# Altium schematic sheet TEMPLATE_Connectors.SchDoc: Connectors
size Tabloid; SheetNumber: 4; SheetTotal: 4; Sheet_Name: Connectors; Size: 11x17
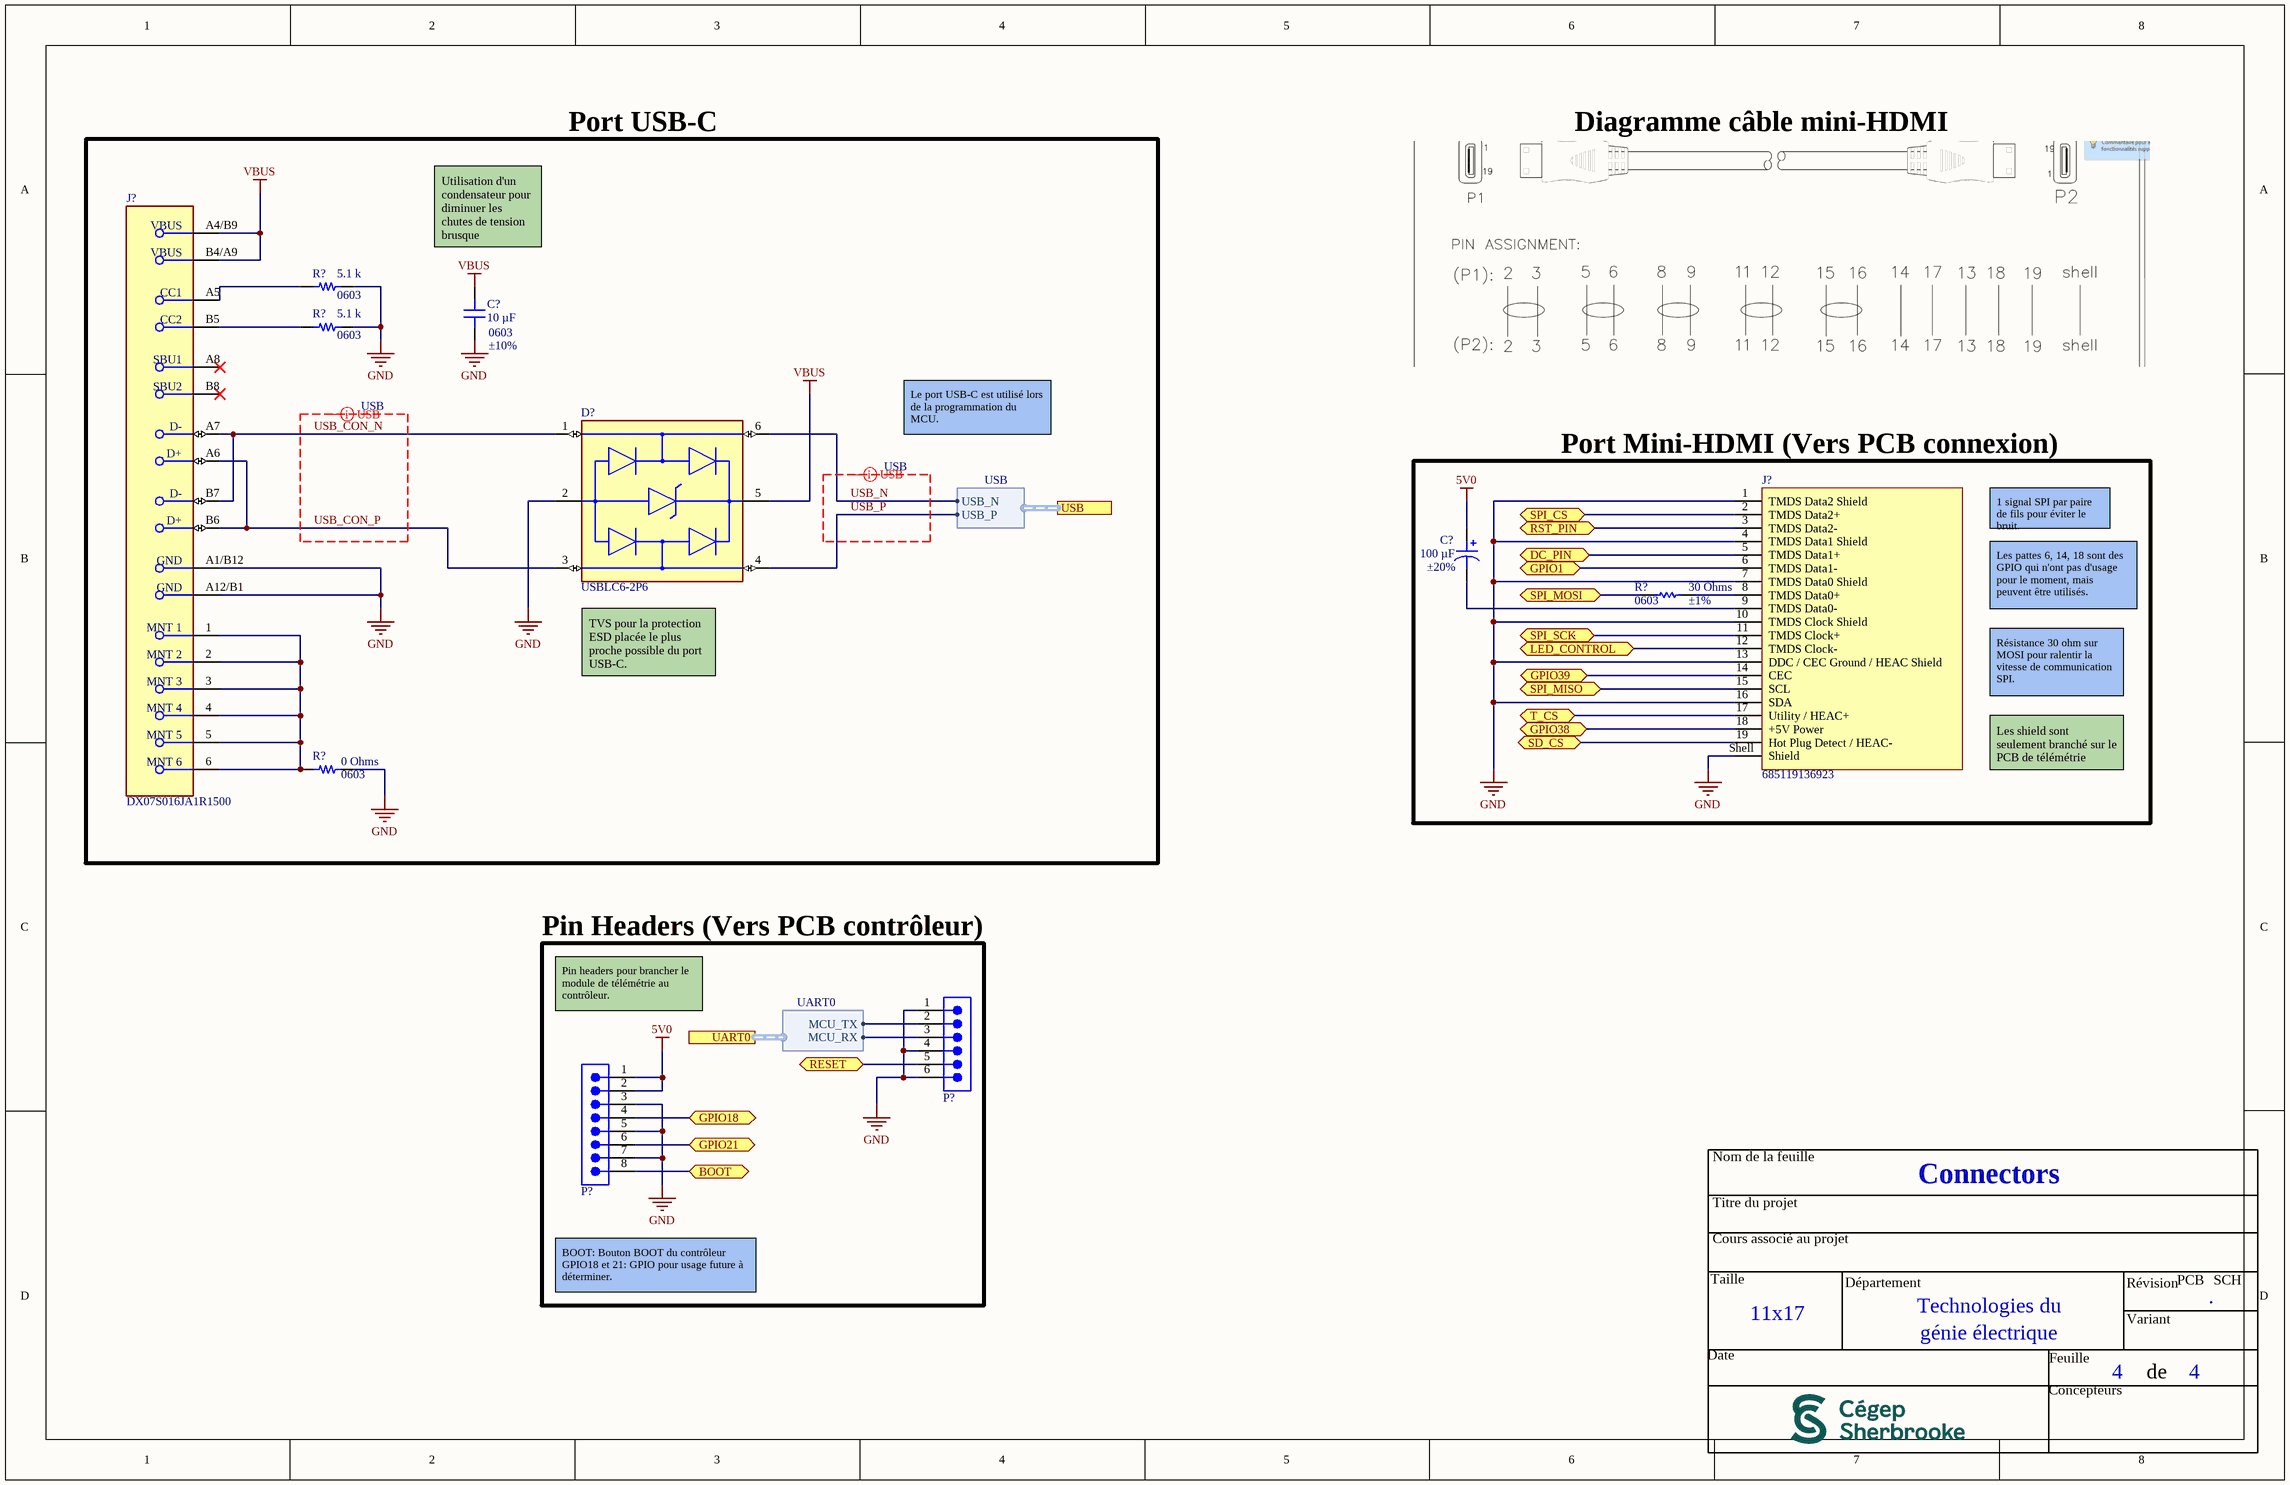
[diagram p0: TEMPLATE_Connectors.SchDoc]

## Parts
(Parts that share a designator on the sheet are numbered #1, #2 ... from top to bottom, then left to right.)
C?#1  Device Package: 0603  Tolerance: ±10%  [CAP 0603_1608]  (hidden comment: 10 µF)
C?#2  100 µF  Tolerance: ±20%  [CAP ALSMD 6.6MM H6.1MM]
D?  USBLC6-2P6  [FP-SOT-666-MFG]
J?#1  DX07S016JA1R1500  [FP-DX07S016JA1R1500-MFG]
J?#2  685119136923  [685119136923]
P?#1  61300611121  [61300611121]  (value not drawn)
P?#2  61300811121  [61300811121]  (value not drawn)
R?#1  Package / Case: 0603  [RES 0603_1608]  (hidden comment: 5.1 k)
R?#2  Package / Case: 0603  [RES 0603_1608]  (hidden comment: 5.1 k)
R?#3  ERJ3EKF30R0V  [RESC1608X55X30LL15T15]  (value not drawn)
R?#4  Supplier Device Package: 0603  [RES 0603_1608]  (hidden comment: 0 Ohms)

## Blocks framed on the sheet
Port USB-C: C?#1 D? J?#1 R?#1 R?#2 R?#4
Port Mini-HDMI (Vers PCB connexion): C?#2 J?#2 R?#3
Pin Headers (Vers PCB contrôleur): P?#1 P?#2

## Ports
BOOT (bidir), DC_PIN (bidir), GPIO1 (bidir), GPIO18 (bidir), GPIO21 (bidir), GPIO38 (bidir), GPIO39 (bidir), LED_CONTROL (bidir), RESET (bidir), RST_PIN (bidir), SD_CS (bidir), SPI_CS (bidir), SPI_MISO (bidir), SPI_MOSI (bidir), SPI_SCK (bidir), T_CS (bidir), UART0 (harness UART0), USB (harness USB)

## Harnesses
UART0: MCU_TX, MCU_RX
USB: USB_N, USB_P

## Nets
5V0: C?#2.1 P?#2.1 P?#2.2
GND: C?#1.1 D?.2(GND) J?#1.A1/B12(GND) J?#1.A12/B1(GND) J?#2.1(TMDS_Data2_Shield) J?#2.4(TMDS_Data1_Shield) J?#2.7(TMDS_Data0_Shield) J?#2.10(TMDS_Clock_Shield) J?#2.13(DDC_/_CEC_Ground_/_HEAC_Shield) J?#2.16(SDA) J?#2.Shell(Shield) P?#1.1 P?#1.4 P?#1.6 P?#2.3 P?#2.5 P?#2.7 R?#1.1 R?#2.1 R?#4.2
VBUS: C?#1.2 D?.5(VBUS) J?#1.A4/B9(VBUS) J?#1.B4/A9(VBUS)
BOOT: P?#2.8 ; port BOOT
DC_PIN: J?#2.5(TMDS_Data1+) ; port DC_PIN
GPIO1: J?#2.6(TMDS_Data1-) ; port GPIO1
GPIO18: P?#2.4 ; port GPIO18
GPIO21: P?#2.6 ; port GPIO21
GPIO38: J?#2.18(+5V_Power) ; port GPIO38
GPIO39: J?#2.14(CEC) ; port GPIO39
LED_CONTROL: J?#2.12(TMDS_Clock-) ; port LED_CONTROL
RESET: P?#1.5 ; port RESET
RST_PIN: J?#2.3(TMDS_Data2-) ; port RST_PIN
SD_CS: J?#2.19(Hot_Plug_Detect_/_HEAC-) ; port SD_CS
SPI_CS: J?#2.2(TMDS_Data2+) ; port SPI_CS
SPI_MISO: J?#2.15(SCL) ; port SPI_MISO
SPI_MOSI: R?#3.1 ; port SPI_MOSI
SPI_SCK: J?#2.11(TMDS_Clock+) ; port SPI_SCK
T_CS: J?#2.17(Utility_/_HEAC+) ; port T_CS
USB_CON_N: D?.1(I/O1) J?#1.A7(D-) J?#1.B7(D-)
USB_CON_P: D?.3(I/O2) J?#1.A6(D+) J?#1.B6(D+)
USB_N: D?.6(I/O1) ; port USB.USB_N
USB_P: D?.4(I/O2) ; port USB.USB_P
NetC?#2_2: C?#2.2 J?#2.9(TMDS_Data0-)
NetJ?#1_1: J?#1.1(MNT_1) J?#1.2(MNT_2) J?#1.3(MNT_3) J?#1.4(MNT_4) J?#1.5(MNT_5) J?#1.6(MNT_6) R?#4.1
NetJ?#1_A5: J?#1.A5(CC1) R?#1.2
NetJ?#1_B5: J?#1.B5(CC2) R?#2.2
NetJ?#2_8: J?#2.8(TMDS_Data0+) R?#3.2
NetP?#1_2: P?#1.2 ; port UART0.MCU_TX
NetP?#1_3: P?#1.3 ; port UART0.MCU_RX

Not connected (* = marked no-connect by the designer): J?#1 A8(SBU1)* B8(SBU2)*

## Layout directives
differential pair: USB_CON_N, USB_CON_P, USB_N, USB_P

## Notes on the sheet
- Diagramme câble mini-HDMI
- Utilisation d'un condensateur pour diminuer les chutes de tension brusque
- USB
- Le port USB-C est utilisé lors de la programmation du MCU.
- 1 signal SPI par paire de fils pour éviter le bruit.
- (near R?#3) 0603
- (near R?#3) 30 Ohms
- (near R?#3) ±1%
- Les pattes 6, 14, 18 sont des GPIO qui n'ont pas d'usage pour le moment, mais peuvent être utilisés.
- (near D?) TVS pour la protection ESD placée le plus proche possible du port USB-C.
- Résistance 30 ohm sur MOSI pour ralentir la vitesse de communication SPI.
- Les shield sont seulement branché sur le PCB de télémétrie
- Pin headers pour brancher le module de télémétrie au contrôleur.
- BOOT: Bouton BOOT du contrôleur GPIO18 et 21: GPIO pour usage future à déterminer.
- Nom de la feuille
- Titre du projet
- Cours associé au projet
- Taille
- Département
- Technologies du
- Révision
- PCB
- .
- SCH
- Date
- génie électrique
- Feuille
- Variant
- de
- Concepteurs

## Library data of the parts
C?#1 = GRT188R61A106KE13D: CAP CER 10UF 10V X5R 0603; manufacturer: Murata Electronics; Part Number: GRT188R61A106KE13D; Value: 10 µF; Applications: Automotive; Capacitance: 10 µF; componentlink1description: Datasheet; componentlink1url: https://search.murata.co.jp/Ceramy/image/img/A01X/G101/ENG/GRT188R61A106KE13-01.pdf; componentlink2description: DigiKey Link; componentlink2url: https://www.digikey.com/en/products/detail/murata-electronics/GRT188R61A106KE13D/5416733; Features: Derating Recommended; lastupdated: 2/9/2024 8:10:30 PM; Lifecycle Status: Active; Minimum Order: 1; Mounting Type: Surface Mount, MLCC; Operating Temperature: -55°C ~ 85°C; Package / Case: 0603 (1608 Metric); packaging: TapeAndReel; partid: 2522; Part Status: Active; price: 0.06; Ratings: AEC-Q200; series: GRT; Size / Dimension: 0.063" L x 0.031" W (1.60mm x 0.80mm); Supplier 1: DigiKey; Supplier Part Number 1: 490-12311-1-ND; Temperature Coefficient: X5R; Thickness (Max): 0.037" (0.95mm); Voltage - Rated: 10V
C?#2 = 10SGV100M6.3X6.1: CAP ALUM 100UF 20% 10V SMD; manufacturer: Rubycon; Lifetime @ Temp.: 2000 Hrs @ 105°C; Polarization: Polar; Ripple Current @ High Frequency: 85.2 mA @ 10 kHz; Ripple Current @ Low Frequency: 71 mA @ 120 Hz; Surface Mount Land Size: 0.260" L x 0.260" W (6.60mm x 6.60mm); Part Number: 10SGV100M6.3X6.1; Applications: Automotive; Capacitance: 100 µF; componentlink1description: Datasheet; componentlink1url: http://www.rubycon.co.jp/en/catalog/e_pdfs/aluminum/e_sgv.pdf; componentlink2description: DigiKey Link; componentlink2url: https://www.digikey.com/en/products/detail/rubycon/10SGV100M6-3X6-1/3568604; Device Package: Radial, Can - SMD; Height - Seated (Max): 0.240" (6.10mm); lastupdated: 6/3/2024 8:16:10 PM; Lifecycle Status: Active; Minimum Order: 1; Mounting Type: Surface Mount; Operating Temperature: -55°C ~ 105°C; Package / Case: Radial, Can - SMD; packaging: TapeAndReel; partid: 8082; Part Status: Active; price: 0.08; Ratings: AEC-Q200; series: SGV; Size / Dimension: 0.248" Dia (6.30mm); Supplier 1: DigiKey; Supplier Part Number 1: 1189-2392-1-ND; value: 100 µF; Voltage - Rated: 10 V
D? = CMP-12225-000058-1: TVS DIODE 5.25V 17V SOT666; Min Breakdown Voltage: 6V; Power Line Protection: Yes; Element Configuration: Dual; Test Current: 1mA; Working Voltage: 5V; Number of Channels: 2; Max Reverse Leakage Current: 150nA; Direction: Unidirectional; Peak Pulse Current: 5A; Number of Elements: 1; Capacitance: 3.5pF; Max Breakdown Voltage: 6V; Height: 0.6mm; Depth: 1.3mm; Contact Plating: Tin; Reverse Breakdown Voltage: 6V; REACH SVHC: No SVHC; Operating Supply Voltage: 5V; Width: 1.3mm; Max Operating Temperature: 125°C; Reverse Standoff Voltage: 5V; ESD Protection: Yes; Package Quantity: 1; Termination: SMD/SMT; Length: 1.7mm; Leakage Current: 150nA; Number of Bidirectional Channels: 2; Case/Package: SOT-666; Min Operating Temperature: -40°C; Number of Pins: 6; Clamping Voltage: 17V; Breakdown Voltage: 6V; Lead Free: Lead Free; Radiation Hardening: No; Packaging: Tape and Reel; Mount: Surface Mount; Polarity: Unidirectional
J?#1 = CMP-19038-000003-1: CONN RCP USB2.0 TYP C 24P SMD RA
J?#2 = CMP-1502-00171-2: NexarPartId: 19499823; Number of Contacts: 19; Gender: Receptacle; Operating Supply Voltage: 40V; Contact Resistance: 30mΩ; Body Material: Brass; Connector Type: HDMI; Current Rating: 500mA; Insulation Resistance: 100MΩ; Lead Free: Lead Free; Max Operating Temperature: 85°C; Packaging: Tape and Reel; Min Operating Temperature: -25°C; Features: Shielded; Orientation: Horizontal; Height: 3.45mm; Number of Positions: 19; Voltage Rating: 40V; Number of Pins: 19; Mount: Horizontal, Surface Mount; Contact Material: Gold; Termination: SMD/SMT; Contact Plating: Gold; RoHS: Compliant; REACH SVHC: Unknown
P?#1 = 61300611121: WR-PHD Pin Header, THT, Vertical, pitch 2.54mm, 1 Row, 6P; Manufacturer: Wurth Elektronik; Contact Resistance: 20mOhm; Rated Current: 3A; Working Voltage: 250V; Withstanding Voltage: 500V; Manufacturer Part Number: 61300611121; Category: Board-to-Board Connectors; Match Code: WR-PHD; ComponentLink1Description: Website Link; ComponentLink1URL: https://www.we-online.com/redexpert/article/61300611121?ad; ComponentLink2Description: Datasheet Link; ComponentLink2URL: https://www.we-online.com/redexpert/spec/61300611121?ad; Mount: Through Hole; Operating Temperature Max: 105°C; Operating Temperature Min: -40°C; Packaging: Bag; Gender: Pin Header; Number of Pins: 6; Number of Rows: 1; Orientation: Vertical; Pitch: 2.54mm
P?#2 = 61300811121: WR-PHD Pin Header, THT, Vertical, pitch 2.54mm, 1 Row, 8P; Manufacturer: Wurth Elektronik; Contact Resistance: 20mOhm; Rated Current: 3A; Working Voltage: 250V; Withstanding Voltage: 500V; Manufacturer Part Number: 61300811121; Category: Board-to-Board Connectors; Match Code: WR-PHD; ComponentLink1Description: Website Link; ComponentLink1URL: https://www.we-online.com/redexpert/article/61300811121?ad; ComponentLink2Description: Datasheet Link; ComponentLink2URL: https://www.we-online.com/redexpert/spec/61300811121?ad; Mount: Through Hole; Operating Temperature Max: 105°C; Operating Temperature Min: -40°C; Packaging: Bag; Gender: Pin Header; Number of Pins: 8; Number of Rows: 1; Orientation: Vertical; Pitch: 2.54mm
R?#1 R?#2 = RMCF0603FT5K10: RES 5.1K OHM 1% 1/10W 0603; Manufacturer: Stackpole Electronics Inc; Power (Watts): 0.1W, 1/10W; Resistance: 5.1 kOhms; Temperature Coefficient: ±100ppm/°C; Part Number: RMCF0603FT5K10; Value: 5.1 k; ComponentLink1Description: Datasheet; ComponentLink1URL: https://www.seielect.com/catalog/sei-rmcf_rmcp.pdf; ComponentLink2Description: DigiKey Link; ComponentLink2URL: https://www.digikey.com/en/products/detail/stackpole-electronics-inc/RMCF0603FT5K10/1760908; Composition: Thick Film; Device Package: 0603 (1608 Metric); Features: Automotive AEC-Q200; Height - Seated (Max): 0.022" (0.55mm); LastUpdated: 2/9/2024 8:43:14 PM; Lifecycle Status: Active; Minimum Order: 1; Number of Terminations: 2; Operating Temperature: -55°C ~ 155°C; Packaging: CutTape; PartId: 10617; Part Status: Active; Price: 0.01; Ratings: AEC-Q200; Series: RMCF; Size / Dimension: 0.061" L x 0.031" W (1.55mm x 0.80mm); Supplier 1: DigiKey; Supplier Part Number 1: RMCF0603FT5K10CT-ND; Tolerance: ±1%
R?#3 = CMP-2000-00423-1: Manufacturer: Panasonic; Part Number: ERJ3EKF30R0V
R?#4 = JR0603X26E: 0603 26 AMP JUMPER; Manufacturer: Ohmite; Power (Watts): 0.135W; Part Number: JR0603X26E; Value: 0 Ohms; ComponentLink1Description: Datasheet; ComponentLink1URL: https://www.ohmite.com/assets/docs/res_jr.pdf?r=false; ComponentLink2Description: DigiKey Link; ComponentLink2URL: https://www.digikey.com/en/products/detail/ohmite/JR0603X26E/10233371; Composition: Metal Element; Device Package: 0603 (1608 Metric); Height - Seated (Max): 0.022" (0.55mm); LastUpdated: 2/9/2024 8:43:29 PM; Lifecycle Status: Active; Minimum Order: 1; Number of Terminations: 2; Operating Temperature: -55°C ~ 150°C; Package / Case: 0603 (1608 Metric); Packaging: TapeAndReel; PartId: 6812; Part Status: Active; Price: 0.10; Resistance: 0 Ohms; Series: JR; Size / Dimension: 0.063" L x 0.031" W (1.60mm x 0.80mm); Supplier 1: DigiKey; Supplier Part Number 1: JR0603X26ECT-ND; Tolerance: Jumper